# Altium project ZStation_R1.PrjPcb
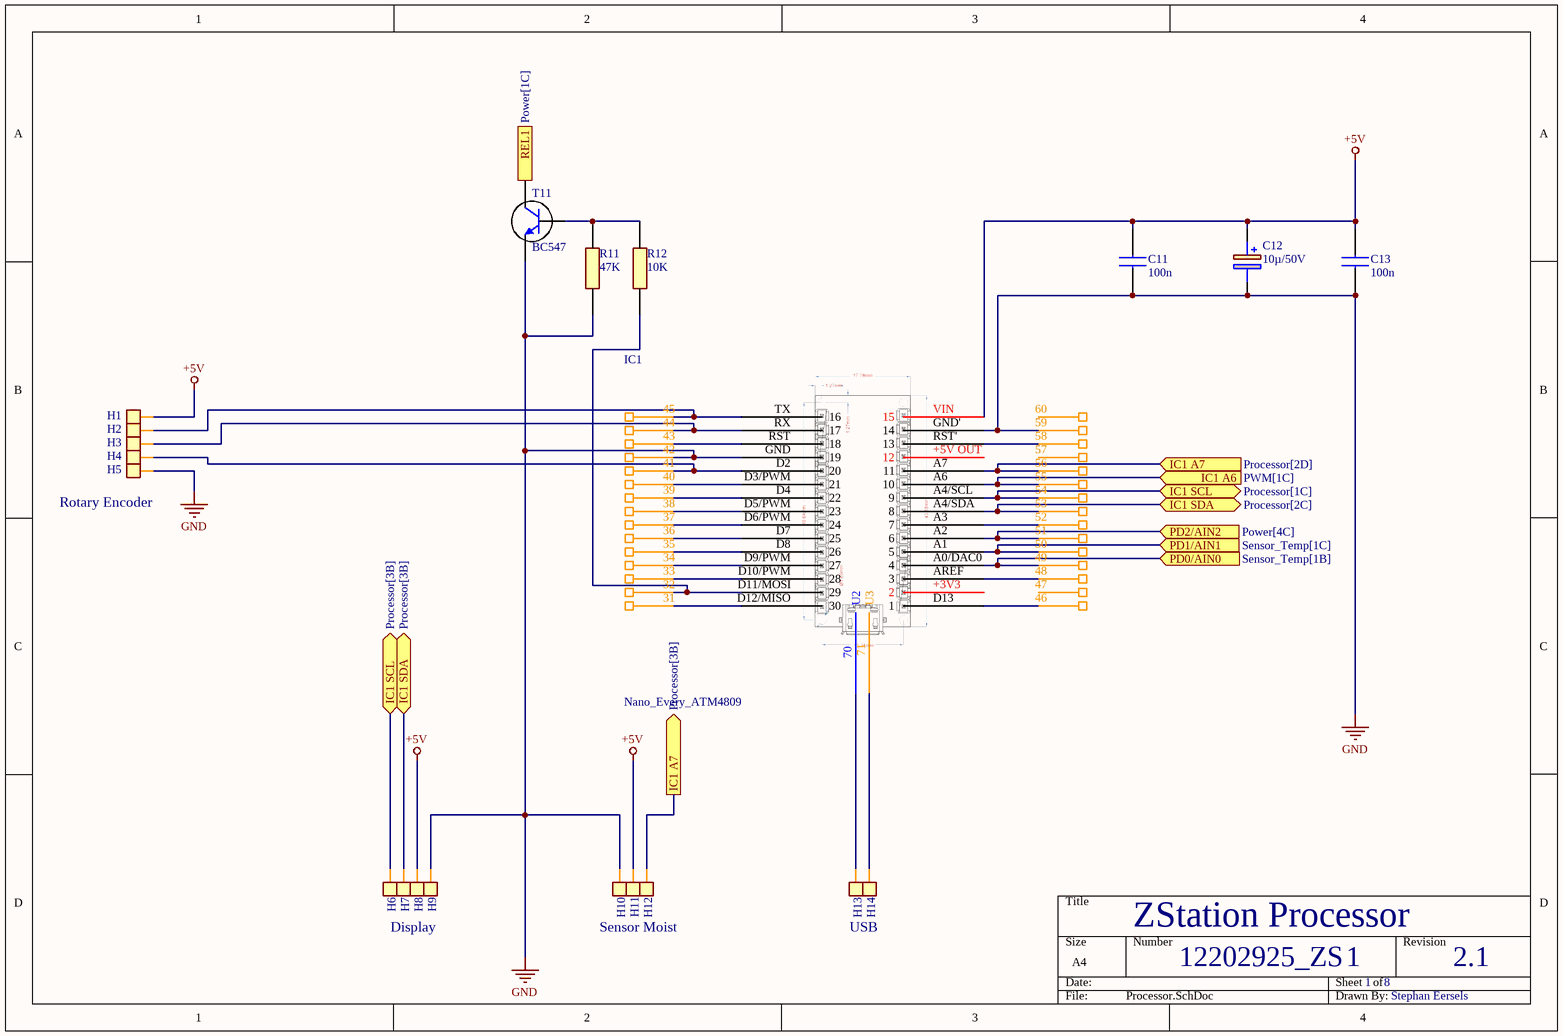
[diagram p0: Processor.SchDoc]
9 sheets, 79 parts. Net scope: flat (ports and power ports of the same name join across sheets).
Board file: Main_R6.PcbDoc
Sheets:
  Processor.SchDoc
  Power.SchDoc
  PWM.SchDoc
  Sensor_Temp.SchDoc
  Senor_Moist.SchDoc
  Rotary_Encoder.SchDoc
  Display.SchDoc
  Valve.SchDoc
  Led_Ring.SchDoc

## Sheet Processor.SchDoc: ZStation Processor
size A4; Engineer: Stephan Eersels; DocumentNumber: 12202925_ZS; Revision: 2.1; SheetNumber: 1; SheetTotal: 8

### Parts
C11  100n  [RDE5C1H330J0M1H03A]
C12  10µ/50V  [CAPPRD200W50D525H1250]
C13  100n  [RDE5C1H330J0M1H03A]
H1  HFS  [Header_F_S]  (value not drawn)
H2  HFS  [Header_F_S]  (value not drawn)
H3  HFS  [Header_F_S]  (value not drawn)
H4  HFS  [Header_F_S]  (value not drawn)
H5  HFS  [Header_F_S]  (value not drawn)
H6  HFS  [Header_F_S]  (value not drawn)
H7  HFS  [Header_F_S]  (value not drawn)
H8  HFS  [Header_F_S]  (value not drawn)
H9  HFS  [Header_F_S]  (value not drawn)
H10  HFS  [Header_F_S]  (value not drawn)
H11  HFS  [Header_F_S]  (value not drawn)
H12  HFS  [Header_F_S]  (value not drawn)
H13  HFS  [Header_F_S]  (value not drawn)
H14  HFS  [Header_F_S]  (value not drawn)
IC1  Nano_Every_ATM4809  [Every_Nano_4809]
R11  47K  [VISHAY_CMF_60]
R12  10K  [VISHAY_CMF_60]
T11  BC547  [ONSC-TO-92-3-29-11]

### Ports
IC1 A6 (in, see PWM[1C]), IC1 A7 (in, see Processor[2D]), IC1 A7 (out, see Processor[3B]), IC1 SCL (bidir, see Processor[1C]), IC1 SCL (bidir, see Processor[3B]), IC1 SDA (bidir, see Processor[2C]), IC1 SDA (bidir, see Processor[3B]), PD0/AIN0 (in, see Sensor_Temp[1B]), PD1/AIN1 (in, see Sensor_Temp[1C]), PD2/AIN2 (in, see Power[4C]), REL1 (in, see Power[1C])

### Nets
+5V: C11.2 C12.1(+) C13.2 H1.1(HF) H8.1(HF) H11.1(HF) IC1.VIN(15)
GND: C11.1 C12.2(-) C13.1 H5.1(HF) H9.1(HF) H10.1(HF) IC1.42(BIS) IC1.59(BIS) IC1.GND(19) IC1.GND'(14) R11.1 T11.3(E)
NetC41_2: IC1.49(BIS) IC1.A0/DAC0(4) ; port PD0/AIN0
NetC43_2: IC1.50(BIS) IC1.A1(5) ; port PD1/AIN1
NetD1_2: T11.1(C) ; port REL1
NetD2_1: IC1.51(BIS) IC1.A2(6) ; port PD2/AIN2
NetH2_1: H2.1(HF) IC1.45(BIS) IC1.TX(16)
NetH3_1: H3.1(HF) IC1.44(BIS) IC1.RX(17)
NetH4_1: H4.1(HF) IC1.41(BIS) IC1.D2(20)
NetH6_1: H6.1(HF) IC1.54(BIS) IC1.A4/SCL(9) ; port IC1 SCL
NetH7_1: H7.1(HF) IC1.53(BIS) IC1.A4/SDA(8) ; port IC1 SDA
NetH12_1: H12.1(HF) IC1.56(BIS) IC1.A7(11) ; port IC1 A7
NetH13_1: H13.1(HF) IC1.70(U2)
NetH14_1: H14.1(HF) IC1.71(U3)
NetIC1_31: IC1.31(BIS) IC1.D12/MISO(30)
NetIC1_32: IC1.32(BIS) IC1.D11/MOSI(29) R12.1
NetIC1_33: IC1.33(BIS) IC1.D10/PWM(28)
NetIC1_34: IC1.34(BIS) IC1.D9/PWM(27)
NetIC1_35: IC1.35(BIS) IC1.D8(26)
NetIC1_36: IC1.36(BIS) IC1.D7(25)
NetIC1_37: IC1.37(BIS) IC1.D6/PWM(24)
NetIC1_38: IC1.38(BIS) IC1.D5/PWM(23)
NetIC1_39: IC1.39(BIS) IC1.D4(22)
NetIC1_40: IC1.40(BIS) IC1.D3/PWM(21)
NetIC1_43: IC1.43(BIS) IC1.RST(18)
NetIC1_46: IC1.46(BIS) IC1.D13(1)
NetIC1_48: IC1.48(BIS) IC1.AREF(3)
NetIC1_52: IC1.52(BIS) IC1.A3(7)
NetIC1_55: IC1.55(BIS) IC1.A6(10) ; port IC1 A6
NetIC1_58: IC1.58(BIS) IC1.RST'(13)
NetR11_2: R11.2 R12.2 T11.2(B)

Not connected (* = marked no-connect by the designer): IC1 47(BIS) 57(BIS) 60(BIS) +3V3(2) +5V OUT(12)

### Notes on the sheet
- Rotary Encoder
- Display
- Sensor Moist
- USB

### Library data of the parts
C11 C13 = C315C103K5R5TA7303: GoldMax 300 Comm X7R, Ceramic, 0.01 uF, 10%, 50 VDC, 125 VDC, 125C, -55C, X7R, GoldMax, Commercial Standard, 2.5 % , 100 GOhms, 3.81mm, 3.14mm, 2.54mm, Lead Spacing = 2.54mm, 18mm, 0.51mm, 2500, 80; Manufacturer_Name: KEMET; Geometry.Height: 4.66mm; Mouser Part Number: 80-C315C103K5R-TR; Mouser Price/Stock: https://www.mouser.co.uk/ProductDetail/KEMET/C315C103K5R5TA7303?qs=LJ1pyEEo5rYBfSJP9%252BZ%252BkA%3D%3D; Manufacturer_Part_Number: C315C103K5R5TA7303; Datasheet Link: https://content.kemet.com/datasheets/KEM_C1050_GOLDMAX_X7R.pdf
C12 = UKL1H100KDDANA: Cap Aluminum Lytic 10uF 50V 10% (5 X 11mm) Radial 2mm 70mA 1000h 105C; Manufacturer_Name: Nichicon; Geometry.Height: 12.5mm; Mouser Part Number: 647-UKL1H100KDDANA; Mouser Price/Stock: https://www.mouser.co.uk/ProductDetail/Nichicon/UKL1H100KDDANA/?qs=LEOMo9F8%2FjG8Wr15FZX2LA%3D%3D; Manufacturer_Part_Number: UKL1H100KDDANA; Datasheet Link: https://datasheet.datasheetarchive.com/originals/dk/DKDS-9/176714.pdf
H1-H14 = Head_F_S
R11 R12 = RES_68K_10K: Through Hole 1W 10/68 Kohms 1%; Manufacturer_Name: Vishay; Manufacturer_Part_Number: CMF6010K000FKEB; Mouser Part Number: 71-CMF6010K000FKEB; Mouser Price/Stock: https://www.mouser.co.uk/ProductDetail/Vishay-Dale/CMF6010K000FKEB?qs=GEEnpASSx%2Fgpk8SPxIuFzw%3D%3D; Datasheet Link: https://datasheet.datasheetarchive.com/originals/distributors/Datasheets-DGA8/3123891.pdf; Arrow Part Number: CMF6010K000FKEB; Arrow Price/Stock: https://www.arrow.com/en/products/cmf6010k000fkeb/vishay
T11 = Transistor_NPN: Manufacturer: On Semiconductor; PartNumber: BC547C; IC Continuous (A): 0.1; fT Min (MHz): 150; Packing: Bulk Box; Polarity: NPN; Mounting Technology: Through Hole; ComponentLink1URL: http://www.onsemi.com/; ComponentLink1Description: Manufacturer URL; ComponentLink3URL: http://www.onsemi.cn/pub_link/Collateral/2N6426-D.PDF; DatasheetVersion: Rev. 7; PackageVersion: Rev. AM; RoHS: FALSE; ComponentLink2URL: http://www.onsemi.com/pub_link/Collateral/BC546-D.PDF; ComponentLink3Description: Package Specification; PackageDescription: 3-Pin Transistor Outline, Body 4.825 x 3.685 mm, Pitch 1.27 mm; PackageReference: TO-92-3-29-11_AM_SL; ComponentLink2Description: Datasheet

## Sheet Power.SchDoc: ZStation Power
size A4; Engineer: Stephan Eersels; DocumentNumber: 12202925_ZS; Revision: 2.1; SheetNumber: 2; SheetTotal: 9
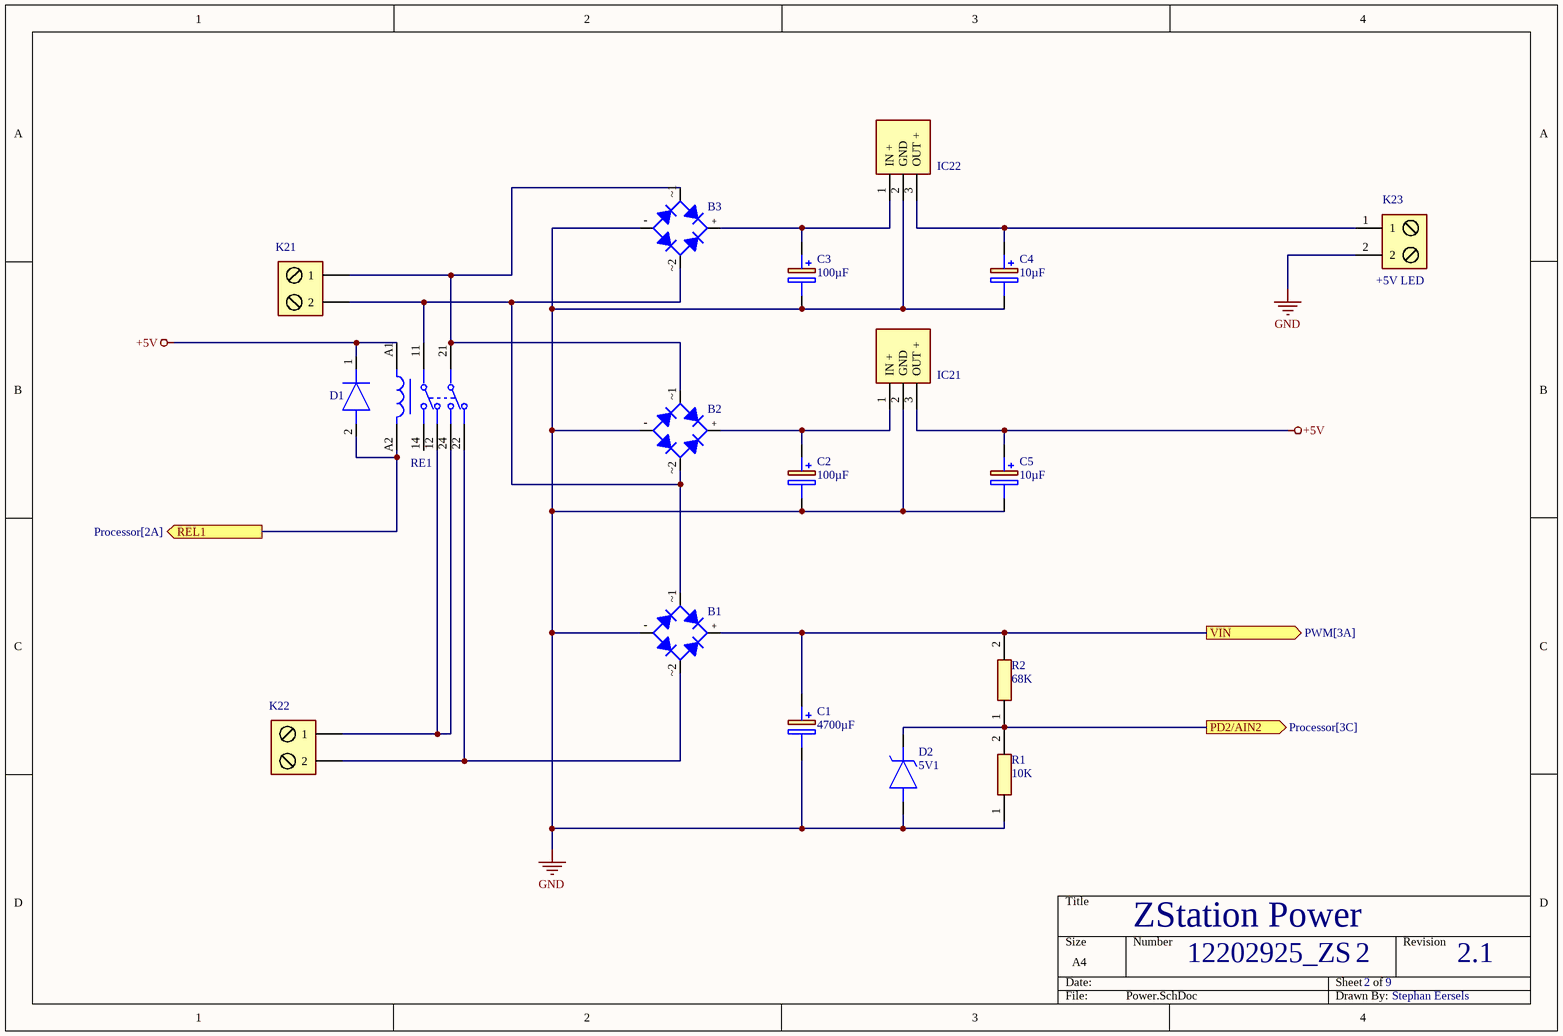
[diagram p1: Power.SchDoc]

### Parts
B1  Bridge_Classic  [GBU6JE345]  (value not drawn)
B2  Bridge_Classic  [GBU6JE345]  (value not drawn)
B3  Bridge_Classic  [GBU6JE345]  (value not drawn)
C1  4700µF  [CAPPRD250W52D630H1250]
C2  100µF  [CAPPRD250W52D630H1250]
C3  100µF  [CAPPRD250W52D630H1250]
C4  10µF  [CAPPRD250W52D630H1250]
C5  10µF  [CAPPRD250W52D630H1250]
D1  (no value)  [1N4007]
D2  5V1  [DIOAD950W60L350D150]
IC21  OKI-78SR-5_1.5-W36-C  [OKI78SR515W36C]  (value not drawn)
IC22  OKI-78SR-5_1.5-W36-C  [OKI78SR515W36C]  (value not drawn)
K21  TBLOCK_2P  [TBLOCK_2P]  (value not drawn)
K22  TBLOCK_2P  [TBLOCK_2P]  (value not drawn)
K23  +5V LED  [TBLOCK_2P]
R1  10K  [VISHAY_CMF_60]
R2  68K  [VISHAY_CMF_60]
RE1  RELAY_GENERAL_PURPOSE  [RT424005F]  (value not drawn)

### Ports
PD2/AIN2 (out, see Processor[3C]), REL1 (out, see Processor[2A]), VIN (out, see PWM[3A])

### Nets
+5V: C5.1(+) D1.1(K) IC21.3(OUT_+) RE1.A1
GND: B1.-(A) B2.-(A) B3.-(A) C1.2(-) C2.2(-) C3.2(-) C4.2(-) C5.2(-) D2.2(A) IC21.2(GND) IC22.2(GND) K23.2 R1.1
NetB1_+: B1.+(K) C1.1(+) R2.2 ; port VIN
NetB1_~1: B1.~1(C) B2.~2(C) B3.~2(C) K21.2 RE1.11
NetB1_~2: B1.~2(C) K22.2 RE1.22
NetB2_+: B2.+(K) C2.1(+) IC21.1(IN_+)
NetB2_~1: B2.~1(C) B3.~1(C) K21.1 RE1.21
NetB3_+: B3.+(K) C3.1(+) IC22.1(IN_+)
NetC4_1: C4.1(+) IC22.3(OUT_+) K23.1
NetD1_2: D1.2(A) RE1.A2 ; port REL1
NetD2_1: D2.1(K) R1.2 R2.1 ; port PD2/AIN2
NetK22_1: K22.1 RE1.12 RE1.24

Not connected (* = marked no-connect by the designer): RE1 14

### Library data of the parts
B1-B3 = Bridge_Classic: Bridge Rectifiers 6.0 Amp 600 Volt; Manufacturer: Diodes Inc; Average Rectified Current-Max: 0.8A; Reverse Voltage-Max [Vrrm]: 600V; Forward Voltage: 1V; Peak Current-Max: 30A; Reverse Current-Max: 5µA; Package Version: 05/2016; Package URL: http://www.diodes.com/_files/packages/MiniDIP.pdf; Datasheet Version: Rev. 13-2, 12/2010; Datasheet URL: http://www.diodes.com/_files/datasheets/ds17003.pdf; Mounting Technology: SurfaceMount; Manufacturer URL: http://www.diodes.com/; Package Reference: MiniDIP-4; Package Description: 4-Pin Small Outline Integrated Circuit, Body 4.7 x 3.8 mm, Pitch 2.5 mm
C1 = CAP_4700µF_50V: Aluminium Electrolytic Capacitors - Radial Leaded WCAP-ATG8 4700uF 50V 20% Radial; Manufacturer_Name: Wurth Elektronik; Manufacturer_Part_Number: 860040473003; Datasheet Link: https://componentsearchengine.com/Datasheets/2/860040473003.pdf; Height: 12.5mm; Mouser Part Number: 710-860040473003; Mouser Price/Stock: https://www.mouser.co.uk/ProductDetail/Wurth-Elektronik/860040473003?qs=0KOYDY2FL29v2%2FALxGsSIw%3D%3D
C2 C3 = CAP_100µF_25V: Aluminium Electrolytic Capacitors - Radial Leaded WCAP-ATUL 100uF 25V 20% Radial; Manufacturer_Name: Wurth Elektronik; Manufacturer_Part_Number: 860040473003; Datasheet Link: https://componentsearchengine.com/Datasheets/2/860040473003.pdf; Height: 12.5mm; Mouser Part Number: 710-860040473003; Mouser Price/Stock: https://www.mouser.co.uk/ProductDetail/Wurth-Elektronik/860040473003?qs=0KOYDY2FL29v2%2FALxGsSIw%3D%3D
C4 C5 = CAP_10µF_50V: Aluminium Electrolytic Capacitors - Radial Leaded WCAP-AT1H 10uF 50V 20% Radial; Manufacturer_Name: Wurth Elektronik; Manufacturer_Part_Number: 860040473003; Datasheet Link: https://componentsearchengine.com/Datasheets/2/860040473003.pdf; Height: 12.5mm; Mouser Part Number: 710-860040473003; Mouser Price/Stock: https://www.mouser.co.uk/ProductDetail/Wurth-Elektronik/860040473003?qs=0KOYDY2FL29v2%2FALxGsSIw%3D%3D
D1 = 1N4007: Diode 1N4007; Manufacturer_Name: Diotec; Datasheet Link: https://diotec.com/tl_files/diotec/files/pdf/datasheets/1n4001.pdf; Manufacturer_Part_Number: 1N4007; Mouser Part Number: 637-1N4007; Mouser Price/Stock: https://www.mouser.co.uk/ProductDetail/Diotec-Semiconductor/1N4007?qs=OlC7AqGiEDmK9mU1uTiCkg%3D%3D; Arrow Part Number: 1N4007; Arrow Price/Stock: https://www.arrow.com/en/products/1n4007/diotec-semiconductor-ag?region=europe
D2 = ZEN_5V1_TH: Zener Diode 5.1 Volt 0.5W 5%; Manufacturer_Name: Vishay; Manufacturer_Part_Number: TZX5V1B-TR; Datasheet Link: https://componentsearchengine.com/Datasheets/1/TZX5V1B-TR.pdf; Mouser Part Number: 78-TZX5V1B; Mouser Price/Stock: https://www.mouser.co.uk/ProductDetail/Vishay-Semiconductors/TZX5V1B-TR?qs=25SNtymhSqO6Jh%252BHM6pQoA%3D%3D; Arrow Part Number: TZX5V1B-TR; Arrow Price/Stock: https://www.arrow.com/en/products/tzx5v1b-tr/vishay?region=nac
IC21 IC22 = OKI-78SR-5_1.5-W36-C: Non-Isolated DC/DC Converter 7.5W 12VIN 5VOUT 1.5A DC/DC; Manufacturer_Name: Murata Electronics; Manufacturer_Part_Number: OKI-78SR-5/1.5-W36-C; Datasheet Link: https://www.murata.com/products/productdata/8807037992990/oki-78sr.pdf?1583754815000; Height: 16.5mm; Mouser Part Number: 580-OKI78SR5/1.5W36C; Mouser Price/Stock: https://www.mouser.co.uk/ProductDetail/Murata-Power-Solutions/OKI-78SR-5-1.5-W36-C?qs=uJpRT2lXVNXJP%252Bo08dQqJQ%3D%3D; Arrow Part Number: OKI-78SR-5/1.5-W36-C; Arrow Price/Stock: https://www.arrow.com/en/products/oki-78sr-51.5-w36-c/murata-power-solutions?region=nac
K21-K23 = TBLOCK_2P: Connector; Manufacturer_Name: Wurth Elektronik; Manufacturer_Part_Number: 691104700002; Height: 7.7mm; Mouser Part Number: 710-691104700002; Mouser Price/Stock: https://www.mouser.co.uk/ProductDetail/Wurth-Elektronik/691104700002?qs=sPbYRqrBIVlxnZf2zP2Y8g%3D%3D
R1 R2 = RES_68K_10K: as R11 on sheet Processor; Datasheet Link: https://datasheet.datasheetarchive.com/originals/distributors/Datasheets-DGA8/3123891.pdf; Mouser Part Number: 71-CMF6010K000FKEB; Mouser Price/Stock: https://www.mouser.co.uk/ProductDetail/Vishay-Dale/CMF6010K000FKEB?qs=GEEnpASSx%2Fgpk8SPxIuFzw%3D%3D; Arrow Part Number: CMF6010K000FKEB; Arrow Price/Stock: https://www.arrow.com/en/products/cmf6010k000fkeb/vishay
RE1 = RELAY_GENERAL_PURPOSE: Manufacturer Part Number: RT424005; Manufacturer: TE Connectivity; Coil Power: 403mW; Throw Configuration: DPDT; Coil Voltage: 5V; Number Of Contacts: 2; Coil Resistance: 62Ω; Current Rating: 8A; Coil Type: Non-Latching; Category: Relay; Octopart: https://octopart.com/5-1393243-9-te+connectivity-41835766; Device Class L3: Power Relays; ComponentLink2URL: https://www.te.com/commerce/DocumentDelivery/DDEController?Action=showdoc&DocId=Data+Sheet%7FRT2%7F1014%7Fpdf%7FEnglish%7FENG_DS_RT2_1014.pdf%7F5-1393243-9; Ambient Temperature Range High: +85°C; ComponentLink2Description: Datasheet; Digikey Description: RELAY GENERAL PURPOSE DPDT 8A 5V; Package: RT424005; Automotive: No; Device Class L1: Electromechanical; Height: 15.7mm; Device Class L2: Relays; Ambient Temperature Range Low: -40°C; Mouser Description: General Purpose Relay, Rt2 Series, Power, Non Latching, Dpdt, 5 Vdc, 8 A Rohs Compliant: Yes; Lead Free: Yes; RoHS: TRUE

## Sheet PWM.SchDoc: ZStation PWM
size A4; Engineer: Stephan Eersels; DocumentNumber: 12202925_ZS; Revision: 2.1; SheetNumber: 3; SheetTotal: 8
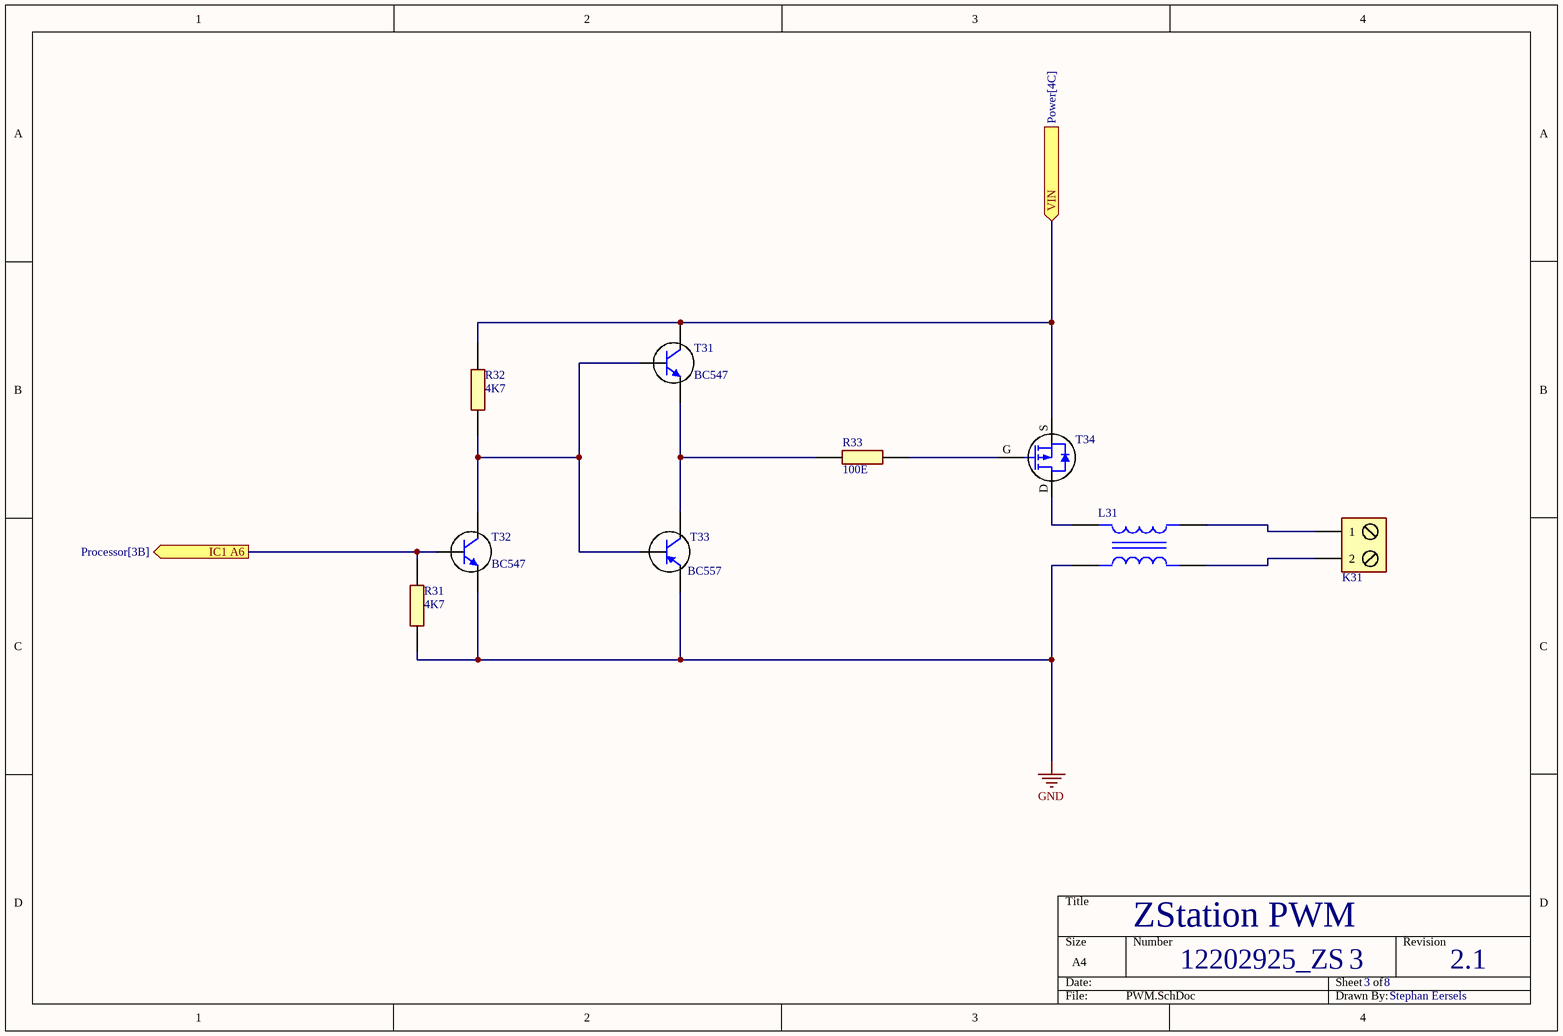
[diagram p2: PWM.SchDoc]

### Parts
K31  TBLOCK_2P  [TBLOCK_2P]  (value not drawn)
L31  Common_Mode_Choke  [2545]  (value not drawn)
R31  4K7  [VISHAY_CMF_60]
R32  4K7  [VISHAY_CMF_60]
R33  100E  [VISHAY_CMF_60]
T31  BC547  [ONSC-TO-92-3-29-11]
T32  BC547  [ONSC-TO-92-3-29-11]
T33  BC557  [ONSC-TO-92-3-29-11]
T34  IRF9Z34NPBF  [IRF9Z34NPBF]  (value not drawn)

### Ports
IC1 A6 (out, see Processor[3B]), VIN (in, see Power[4C])

### Nets
GND: L31.2 R31.1 T32.3(E) T33.3(E)
NetB1_+: R32.2 T31.1(C) T34.S(SOURCE) ; port VIN
NetIC1_55: R31.2 T32.2(B) ; port IC1 A6
NetK31_1: K31.1 L31.4
NetK31_2: K31.2 L31.3
NetL31_1: L31.1 T34.D(DRAIN)
NetR32_1: R32.1 T31.2(B) T32.1(C) T33.2(B)
NetR33_1: R33.1 T34.G(GATE)
NetR33_2: R33.2 T31.3(E) T33.1(C)

### Library data of the parts
K31 = TBLOCK_2P: as K21 on sheet Power; Height: 7.7mm; Mouser Part Number: 710-691104700002; Mouser Price/Stock: https://www.mouser.co.uk/ProductDetail/Wurth-Elektronik/691104700002?qs=sPbYRqrBIVlxnZf2zP2Y8g%3D%3D
L31 = Common_Mode_Choke: Max Current Rating: 2A; Number of Lines: 2; Impedance: 900R; Element Configuration: Dual; Insulation Resistance: 10MR; Test Frequency: 100MHz; DC Resistance (DCR): 60mR; Voltage Rating (DC): 50V; Current Rating: 2.3A; Number of Pins: 4; DC Current: 2A; Mount: Surface Mount; Current: 2A; REACH SVHC: No SVHC; Width: 4.5mm; Case/Package: 1808; Voltage Rating: 50V; Package Quantity: 1; Height: 2mm; Max DC Current: 2A; Packaging: Tape and Reel; Max Operating Temperature: 85°C; Lead Free: Lead Free; Length: 0.185inch; Series: ACM; Radiation Hardening: No; Max Voltage Rating (DC): 50V; Termination: Flat; Depth: 4.7mm; RoHS Compliant: Yes; DC Resistance-Max: 60mR; Min Operating Temperature: -40°C
R31-R33 = RES_68K_10K: as R11 on sheet Processor; Datasheet Link: https://datasheet.datasheetarchive.com/originals/distributors/Datasheets-DGA8/3123891.pdf; Mouser Part Number: 71-CMF6010K000FKEB; Mouser Price/Stock: https://www.mouser.co.uk/ProductDetail/Vishay-Dale/CMF6010K000FKEB?qs=GEEnpASSx%2Fgpk8SPxIuFzw%3D%3D; Arrow Part Number: CMF6010K000FKEB; Arrow Price/Stock: https://www.arrow.com/en/products/cmf6010k000fkeb/vishay
T31 T32 = Transistor_NPN: as T11 on sheet Processor; Mounting Technology: Through Hole; ComponentLink1URL: http://www.onsemi.com/; ComponentLink1Description: Manufacturer URL; ComponentLink3URL: http://www.onsemi.cn/pub_link/Collateral/2N6426-D.PDF; DatasheetVersion: Rev. 7; PackageVersion: Rev. AM; RoHS: FALSE; ComponentLink2URL: http://www.onsemi.com/pub_link/Collateral/BC546-D.PDF; ComponentLink3Description: Package Specification; PackageDescription: 3-Pin Transistor Outline, Body 4.825 x 3.685 mm, Pitch 1.27 mm; PackageReference: TO-92-3-29-11_AM_SL; ComponentLink2Description: Datasheet
T33 = Transistor_PNP: Manufacturer: On Semiconductor; PartNumber: BC557C; Polarity: PNP; IC Continuous (A): -0.1; Packing: Bulk Box; PackageVersion: Rev. AM; RoHS: FALSE; PackageDescription: 3-Pin Transistor Outline, Body 4.825 x 3.685 mm, Pitch 1.27 mm; ComponentLink2Description: Datasheet; DatasheetVersion: Rev. 3; ComponentLink3Description: Package Specification; Mounting Technology: Through Hole; ComponentLink2URL: http://www.onsemi.com/pub_link/Collateral/BC556B-D.PDF; ComponentLink1URL: http://www.onsemi.com/; ComponentLink1Description: Manufacturer URL; ComponentLink3URL: http://www.onsemi.cn/pub_link/Collateral/2N6426-D.PDF; PackageReference: TO-92-3-29-11_AM_SL
T34 = MOSFET_P: Manufacturer: Fairchild Semiconductor; Reel Quantity: 3000; Drain Source Voltage Vds: 20V; Power Dissipation Pd: 500mW; On Resistance Rds(on): 52mohm; Full Power Rating Temperature: 25°C; Voltage Vgs Max: -800mV; Pulse Current Idm: 10A; Rds(on) Test Voltage Vgs: -4.5V; External Depth: 2.5mm; Transistor Case Style: SOT-23; No. of Pins: 3; Continuous Drain Current Id: 2.4A; Voltage Vds Typ: -20V; Voltage Vgs th Max: -1.5V; Transistor Polarity: PChannel; Package Version: Rev. 3, 05/2015; External Width: 3.05mm; External Length / Height: 1.12mm; SMD Marking: 304P; SVHC: NoSVHC(19-Dec-2012); Termination Type: SMD; Datasheet URL: https://www.fairchildsemi.com/datasheets/FD/FDN304P.pdf; Tape Width: 8mm; Mounting Technology: SurfaceMount; Voltage Vgs Rds on Measurement: -4.5V; Operating Temperature Range: -55°Cto+150°C; Current Temperature: 25°C; Operating Temperature Min: -55°C; Threshold Voltage Vgs Typ: -800mV; Package / Case: SOT-23; Manufacturer URL: https://www.fairchildsemi.com/; Voltage Vds: 20V; Datasheet Version: Rev. C, 01/2001; Operating Temperature Max: 150°C; Package Description: 3-Pin Small Outline Transistor, Body 2.92 x 1.4 mm, Pitch 0.95 mm; Current Id Max: 2.4A; Package URL: https://www.fairchildsemi.com/package-drawings/MA/MA03B.pdf; Package Reference: SSOT3L

## Sheet Sensor_Temp.SchDoc: ZStation Sensor Temp
size A4; Engineer: Stephan Eersels; DocumentNumber: 12202925_ZS; Revision: 2.1; SheetNumber: 4; SheetTotal: 8
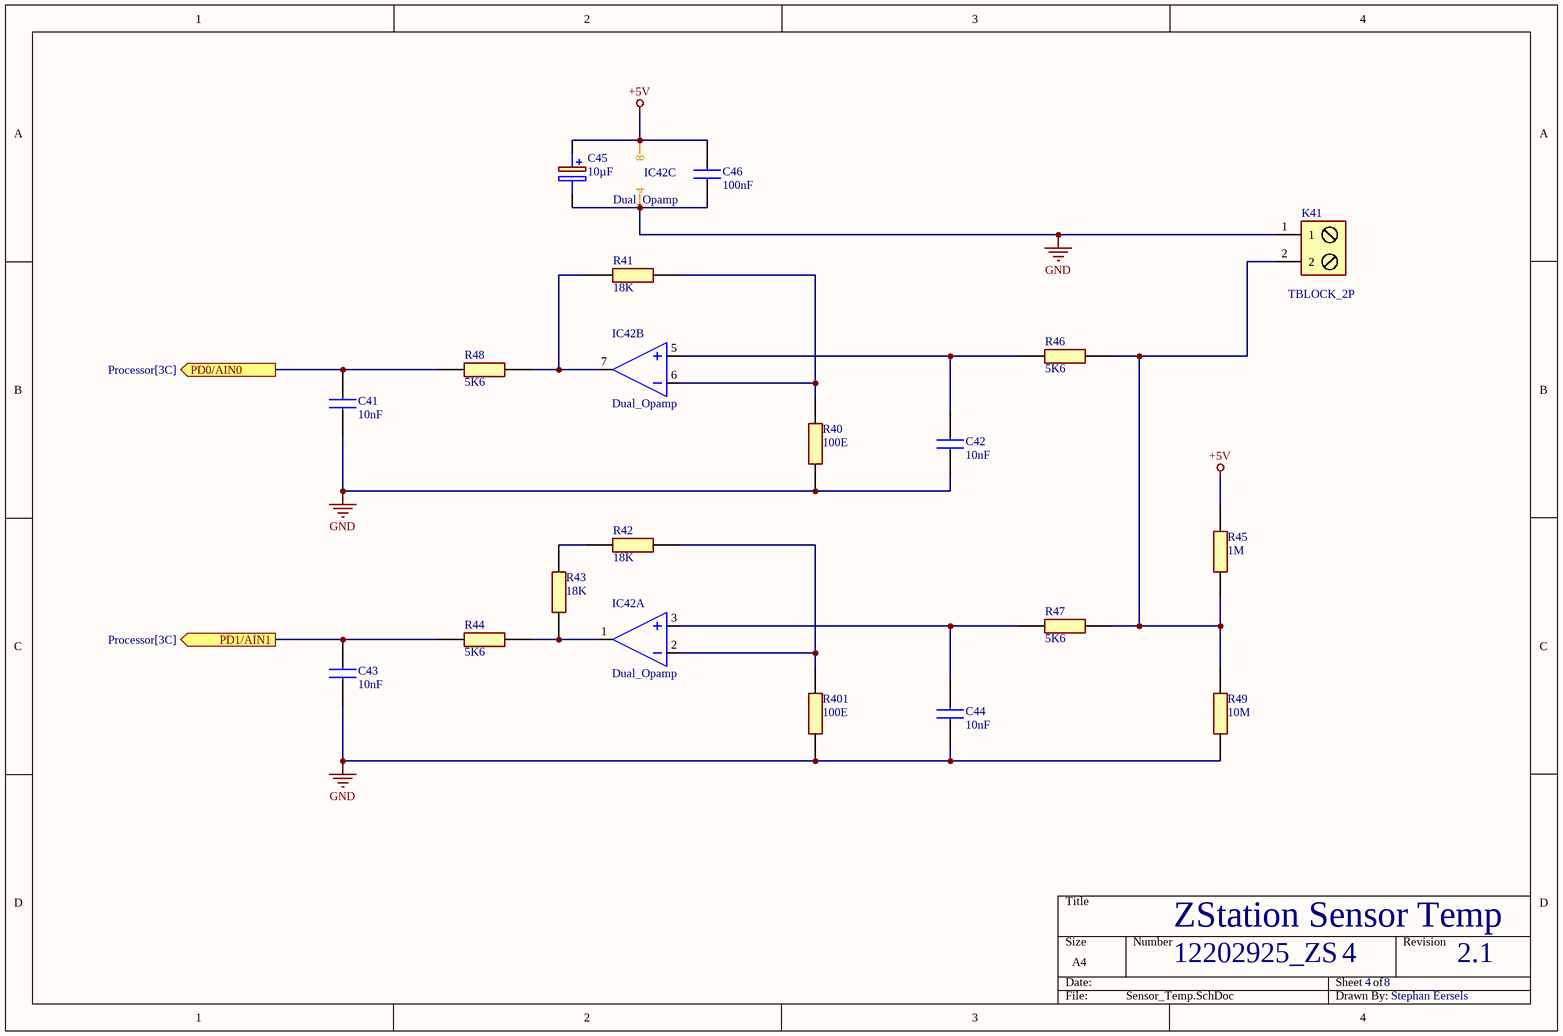
[diagram p3: Sensor_Temp.SchDoc]

### Parts
C41  10nF  [C315C103K5R5TA7303]
C42  10nF  [C315C103K5R5TA7303]
C43  10nF  [C315C103K5R5TA7303]
C44  10nF  [C315C103K5R5TA7303]
C45  10µF  [CAPPRD200W50D525H1250]
C46  100nF  [RDE5C1H330J0M1H03A]
IC42  Dual_Opamp  [DIP781W56P254L950H533Q8N]  (parts A,B,C of 3)
K41  TBLOCK_2P  [TBLOCK_2P]
R40  100E  [VISHAY_CMF_60]
R41  18K  [VISHAY_CMF_60]
R42  18K  [VISHAY_CMF_60]
R43  18K  [VISHAY_CMF_60]
R44  5K6  [VISHAY_CMF_60]
R45  1M  [VISHAY_CMF_60]
R46  5K6  [VISHAY_CMF_60]
R47  5K6  [VISHAY_CMF_60]
R48  5K6  [VISHAY_CMF_60]
R49  10M  [VISHAY_CMF_60]
R401  100E  [VISHAY_CMF_60]

### Ports
PD0/AIN0 (out, see Processor[3C]), PD1/AIN1 (out, see Processor[3C])

### Nets
+5V: C45.1(+) C46.1 IC42.8 R45.1
GND: C41.1 C42.1 C43.1 C44.1 C45.2(-) C46.2 IC42.4 K41.1 R40.2 R49.2 R401.2
NetC41_2: C41.2 R48.2 ; port PD0/AIN0
NetC42_2: C42.2 IC42.5(VINB+) R46.2
NetC43_2: C43.2 R44.2 ; port PD1/AIN1
NetC44_2: C44.2 IC42.3(VINA+) R47.2
NetIC42_1: IC42.1(VOUTA) R43.1 R44.1
NetIC42_2: IC42.2(VINA-) R42.2 R401.1
NetIC42_6: IC42.6(VINB-) R40.1 R41.2
NetIC42_7: IC42.7(VOUTB) R41.1 R48.1
NetK41_2: K41.2 R45.2 R46.1 R47.1 R49.1
NetR42_1: R42.1 R43.2

### Library data of the parts
C41-C44 = C315C103K5R5TA7303: as C11 on sheet Processor; Mouser Part Number: 80-C315C103K5R-TR; Mouser Price/Stock: https://www.mouser.co.uk/ProductDetail/KEMET/C315C103K5R5TA7303?qs=LJ1pyEEo5rYBfSJP9%252BZ%252BkA%3D%3D; Manufacturer_Part_Number: C315C103K5R5TA7303; Datasheet Link: https://content.kemet.com/datasheets/KEM_C1050_GOLDMAX_X7R.pdf
C45 = CAP_10µF_50V: as C4 on sheet Power; Datasheet Link: https://componentsearchengine.com/Datasheets/2/860040473003.pdf; Height: 12.5mm; Mouser Part Number: 710-860040473003; Mouser Price/Stock: https://www.mouser.co.uk/ProductDetail/Wurth-Elektronik/860040473003?qs=0KOYDY2FL29v2%2FALxGsSIw%3D%3D
C46 = CAP_100nF_50V: CAP, 0.1UF, 50V, MLCC, RADIAL; Manufacturer_Name: Murata Electronics; Manufacturer_Part_Number: RDER71H104K0K1H03B; Geometry.Height: 5mm; Mouser Part Number: 81-RDER71H104K0K1H3B; Mouser Price/Stock: https://www.mouser.co.uk/ProductDetail/Murata-Electronics/RDER71H104K0K1H03B?qs=hNud%2FORuBR2GLaz%2FjAabyQ%3D%3D; Datasheet Link: https://psearch.en.murata.com/capacitor/product/RDER71H104K0K1H03B.html
IC42 = Dual_Opamp: Slew Rate: 0.6V/µs; Supply Current: 100uA; Power Supply Rejection Ratio (PSRR): 86dB; Input Offset Voltage (Vos): 4.5mV; Input Bias Current: 1pA; Amplifier Type: GENERAL PURPOSE; Unity Gain Bandwidth Product: 1MHz; Number of Circuits: 2; Output Current: 23mA; Operating Supply Voltage: 5.5V; Min Supply Voltage: 1.8V; Common Mode Rejection Ratio: 60dB; Voltage Gain: 112dB; Max Supply Voltage: 6V; Package Quantity: 60; REACH SVHC: No SVHC; Min Operating Temperature: -40°C; Max Operating Temperature: 125°C; Mount: Through Hole; Nominal Supply Current: 100uA; Height: 3.3mm; Length: 9.27mm; Slew Rate-Nom: 0.6V/µs; Packaging: Rail/Tube; Output Current per Channel: 23mA; Number of Amplifiers: 2; RoHS Compliant: Yes; Radiation Hardening: No; Bandwidth: 1MHz; Lead Free: Lead Free; Width: 6.35mm; Number of Channels: 2; Gain Bandwidth Product: 1MHz; Technology: CMOS; Operating Supply Current: 100uA; Number of Elements: 2; Number of Pins: 8; Input Offset Voltage-Max: 4.5mV; Case/Package: PDIP
K41 = TBLOCK_2P: as K21 on sheet Power; Height: 7.7mm; Mouser Part Number: 710-691104700002; Mouser Price/Stock: https://www.mouser.co.uk/ProductDetail/Wurth-Elektronik/691104700002?qs=sPbYRqrBIVlxnZf2zP2Y8g%3D%3D
R40-R49 R401 = RES_68K_10K: as R11 on sheet Processor; Datasheet Link: https://datasheet.datasheetarchive.com/originals/distributors/Datasheets-DGA8/3123891.pdf; Mouser Part Number: 71-CMF6010K000FKEB; Mouser Price/Stock: https://www.mouser.co.uk/ProductDetail/Vishay-Dale/CMF6010K000FKEB?qs=GEEnpASSx%2Fgpk8SPxIuFzw%3D%3D; Arrow Part Number: CMF6010K000FKEB; Arrow Price/Stock: https://www.arrow.com/en/products/cmf6010k000fkeb/vishay

## Sheet Senor_Moist.SchDoc: ZStation Sensor Moist
size A4; Engineer: Stephan Eersels; DocumentNumber: 12202925_ZS; Revision: 2.1; SheetNumber: 5; SheetTotal: 8

## Sheet Rotary_Encoder.SchDoc: ZStation Rotary Encoder
size A4; Engineer: Stephan Eersels; DocumentNumber: 12202925_ZS; Revision: 2.1; SheetNumber: 6; SheetTotal: 8
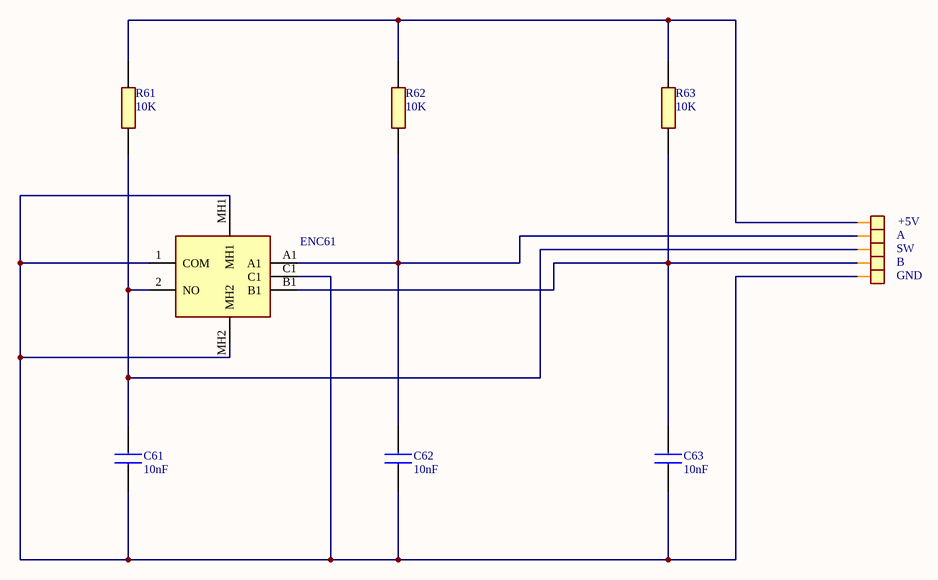
[diagram p4: Rotary_Encoder.SchDoc]

### Parts
C61  10nF  [C315C103K5R5TA7303]
C62  10nF  [C315C103K5R5TA7303]
C63  10nF  [C315C103K5R5TA7303]
ENC61  ROTARY&SWITCH  [PEC11R4225FS0012]  (value not drawn)
H61  +5V  [Header_M_S]
H62  A  [Header_M_S]
H63  SW  [Header_M_S]
H64  B  [Header_M_S]
H65  GND  [Header_M_S]
R61  10K  [VISHAY_CMF_60]
R62  10K  [VISHAY_CMF_60]
R63  10K  [VISHAY_CMF_60]

### Nets
NetC61_1: C61.1 C62.1 C63.1 ENC61.1(COM) ENC61.C1 ENC61.MH1 ENC61.MH2 H65.H?(HF)
NetC61_2: C61.2 ENC61.2(NO) H63.H?(HF) R61.1
NetC62_2: C62.2 ENC61.A1 H62.H?(HF) R62.1
NetC63_2: C63.2 ENC61.B1 H64.H?(HF) R63.1
NetH61_H?: H61.H?(HF) R61.2 R62.2 R63.2

### Library data of the parts
C61-C63 = C315C103K5R5TA7303: as C11 on sheet Processor; Mouser Part Number: 80-C315C103K5R-TR; Mouser Price/Stock: https://www.mouser.co.uk/ProductDetail/KEMET/C315C103K5R5TA7303?qs=LJ1pyEEo5rYBfSJP9%252BZ%252BkA%3D%3D; Manufacturer_Part_Number: C315C103K5R5TA7303; Datasheet Link: https://content.kemet.com/datasheets/KEM_C1050_GOLDMAX_X7R.pdf
ENC61 = ROTARY: Encoder 20mm SHAFT w/SWITCH; Manufacturer_Name: Bourns; Manufacturer_Part_Number: PEC11R-4225F-S0012; Datasheet Link: https://www.bourns.com/docs/product-datasheets/pec11r.pdf?sfvrsn=bb617cbf_11; Height: 31.5mm; Mouser Part Number: 652-PEC11R-4225F-S12; Mouser Price/Stock: https://www.mouser.co.uk/ProductDetail/Bourns/PEC11R-4225F-S0012?qs=Zq5ylnUbLm4jMN%252BFiPmzDg%3D%3D
H61-H65 = Head_M_S
R61-R63 = RES_68K_10K: as R11 on sheet Processor; Datasheet Link: https://datasheet.datasheetarchive.com/originals/distributors/Datasheets-DGA8/3123891.pdf; Mouser Part Number: 71-CMF6010K000FKEB; Mouser Price/Stock: https://www.mouser.co.uk/ProductDetail/Vishay-Dale/CMF6010K000FKEB?qs=GEEnpASSx%2Fgpk8SPxIuFzw%3D%3D; Arrow Part Number: CMF6010K000FKEB; Arrow Price/Stock: https://www.arrow.com/en/products/cmf6010k000fkeb/vishay

## Sheet Display.SchDoc: ZStation Display
size A4; Engineer: Stephan Eersels; DocumentNumber: 12202925_ZS; Revision: 2.1; SheetNumber: 7; SheetTotal: 8

## Sheet Valve.SchDoc: ZStation Valve
size A4; Engineer: Stephan Eersels; DocumentNumber: 12202925_ZS; Revision: 2.1; SheetNumber: 8; SheetTotal: 8

## Sheet Led_Ring.SchDoc: ZStation LED Ring
size A4; Engineer: Stephan Eersels; DocumentNumber: 12202925_ZS; Revision: 2.1; SheetNumber: 9; SheetTotal: 9

## Nets that join several sheets
+5V: Processor (7 pins), Power (C5.1 D1.1 IC21.3 RE1.A1), Sensor_Temp (C45.1 C46.1 IC42.8 R45.1)
GND: Processor (12 pins), Power (13 pins), PWM (L31.2 R31.1 T32.3 T33.3), Sensor_Temp (11 pins)
NetB1_+: Power (B1.+ C1.1 R2.2), PWM (R32.2 T31.1 T34.S)
NetC41_2: Processor (IC1.49 IC1.A0/DAC0), Sensor_Temp (C41.2 R48.2)
NetC43_2: Processor (IC1.50 IC1.A1), Sensor_Temp (C43.2 R44.2)
NetD1_2: Processor (T11.1), Power (D1.2 RE1.A2)
NetD2_1: Processor (IC1.51 IC1.A2), Power (D2.1 R1.2 R2.1)
NetIC1_55: Processor (IC1.55 IC1.A6), PWM (R31.2 T32.2)